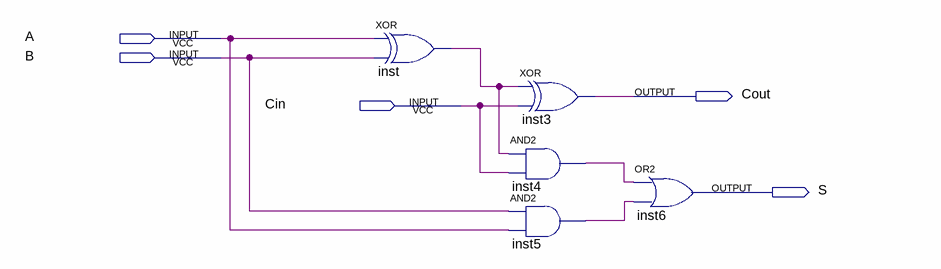
[diagram p0: schematic sheet]
// Quartus schematic fullAddr.bdf as structural Verilog: 5 symbols, 5 pins
module fullAddr (
  input  A,
  input  B,
  input  Cin,
  output Cout,
  output S
);

  wire inst4_out, inst5_out, inst_out;

  xor inst (inst_out, A, B);
  xor inst3 (Cout, inst_out, Cin);
  and inst4 (inst4_out, inst_out, Cin);
  and inst5 (inst5_out, B, A);
  or inst6 (S, inst4_out, inst5_out);
endmodule
